# Altium schematic sheet 05_interface.SchDoc
size 513 x 386 mm
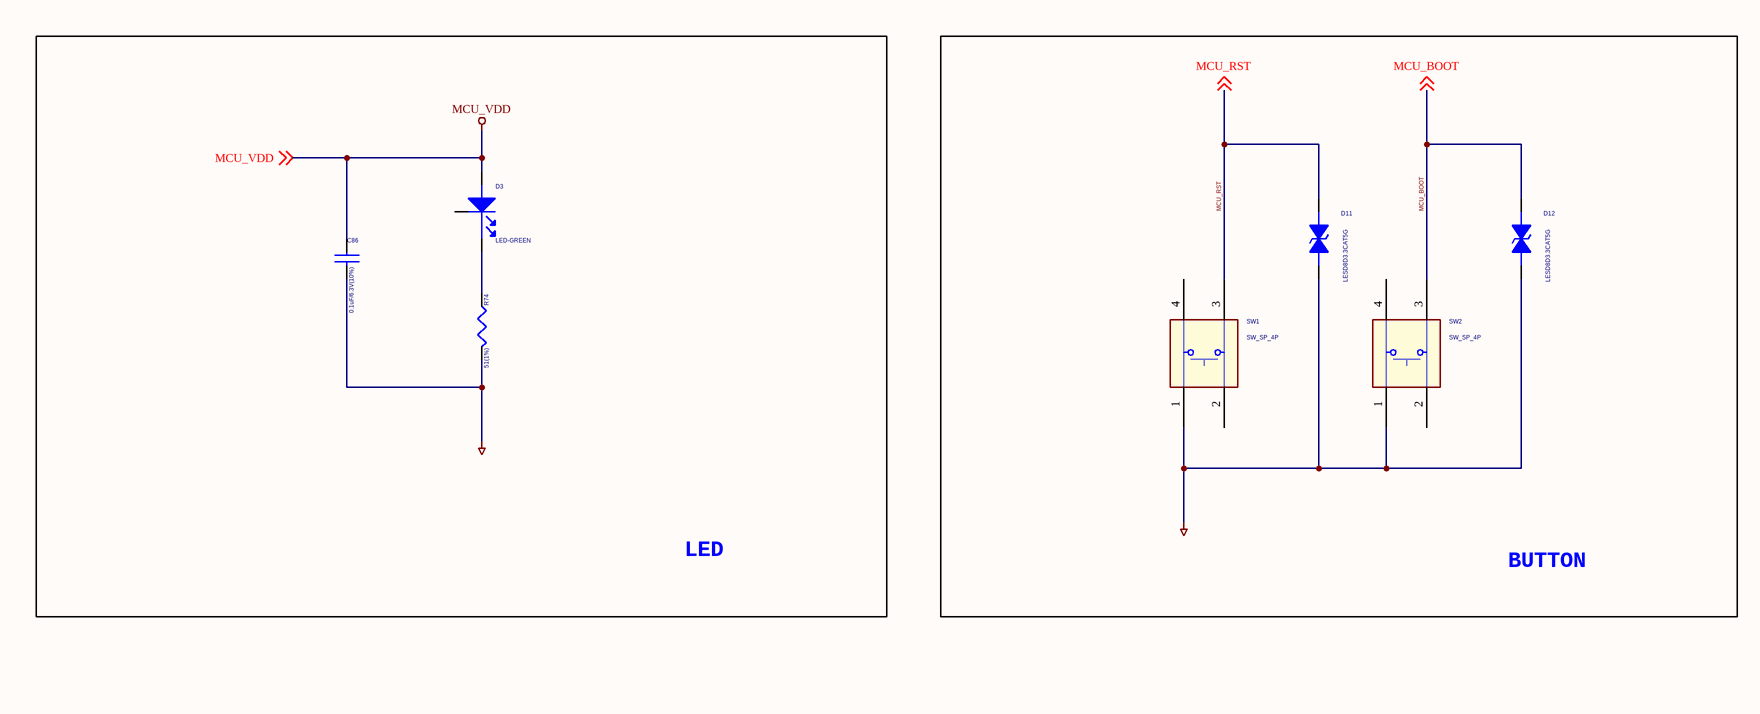
[diagram p0: 05_interface.SchDoc, left]
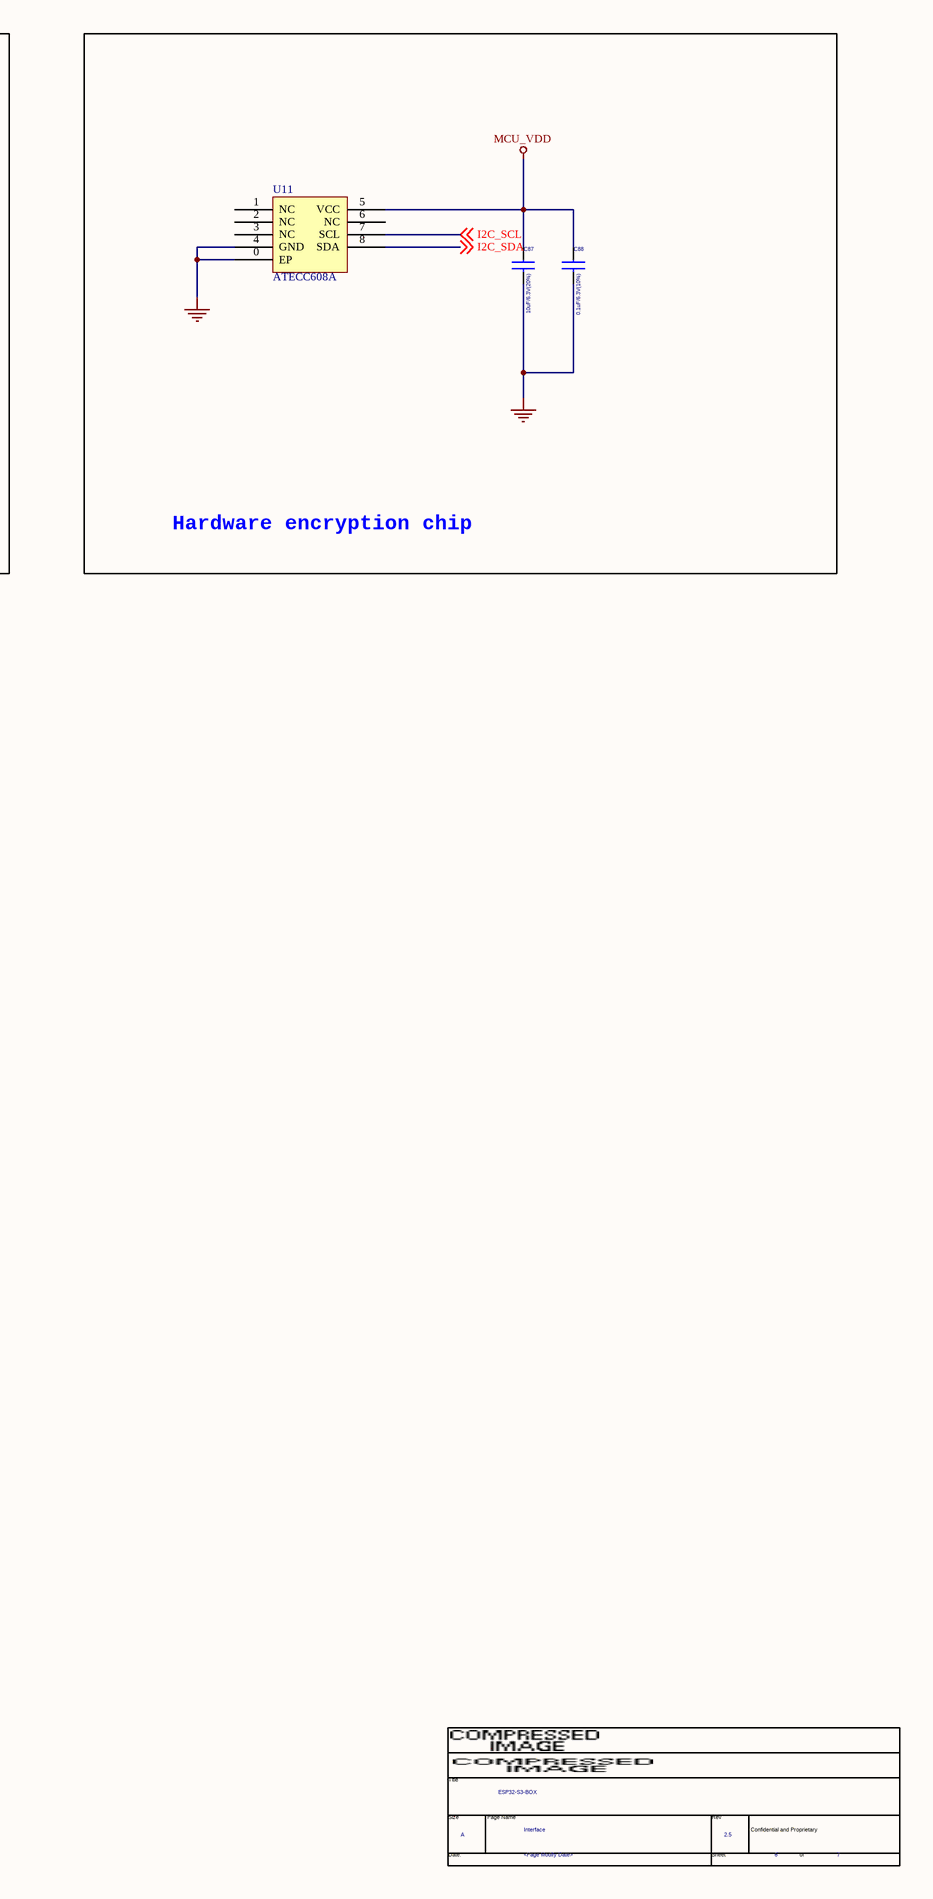
[diagram p1: 05_interface.SchDoc, right]

## Parts
*  Page Modify Date: <Page Modify Date>  Page Name: Interface  Title: ESP32-S3-BOX  Page Size: A  Page Number: 6  Page Count: 7  RevCode: 2.5  (hidden comment: espTitleBlock3)  (graphical)
C86  0.1uF/6.3V(10%)  [0402_C]
C87  10uF/6.3V(20%)  [0402_C]
C88  0.1uF/6.3V(10%)  [0402_C]
D3  LED-GREEN  [0603_L]
D11  LESD8D3.3CAT5G  [SOD-882]
D12  LESD8D3.3CAT5G  [SOD-882]
R74  51(1%)  [0201_R]
SW1  SW_SP_4P  [Key3*4*2.5]
SW2  SW_SP_4P  [Key3*4*2.5]
U11  ATECC608A  [DFN-8_EP_3x3mm]

## Blocks framed on the sheet
LED: C86 D3 R74
BUTTON: D11 D12 SW1 SW2
Hardware encryption chip: C87 C88 U11

## Nets
GND: C86.2 C87.2 C88.2 D11.1 D12.1 R74.2 SW1.1 SW2.1 U11.0(EP) U11.4(GND)
MCU_VDD: C86.1 C87.1 C88.1 D3.1 U11.5(VCC) ; off-sheet MCU_VDD
I2C_SCL: U11.7(SCL) ; off-sheet I2C_SCL
I2C_SDA: U11.8(SDA) ; off-sheet I2C_SDA
MCU_BOOT: D12.2 SW2.3 ; off-sheet MCU_BOOT
MCU_RST: D11.2 SW1.3 ; off-sheet MCU_RST
NetD3_2: D3.2 R74.1

Not connected (* = marked no-connect by the designer): D3 3; SW1 2 4; SW2 2 4; U11 1(NC) 2(NC) 3(NC) 6(NC)

## Notes on the sheet
- (in symbol espTitleBlock3) Title; Size; Page Name; Rev; Confidential and Proprietary; Date:; Sheet; of

## Library data of the parts
* = espTitleBlock3: Doc: ESP32-S3-EYE_V1.0; OrgName: ESPRESSIF
C86 C88 = CAPACITOR: Part Number: ES11045102620001; CODE12: ES11.04.510.2.6.2.00; Part Type: Capacitor
C87 = CAPACITOR: Part Number: ES11047102710000; CODE12: ES11.04.710.2.7.1.00; Part Type: Capacitor
D11 D12 = DIODE_BI_DIR: Part Number: ES31320010000000; CODE12: ES31.32.0010.00.0.0; Part Type: Diode
R74 = RESISTOR: Part Number: ES21021510000001; CODE12: ES21.02.1510.0.00.0; Part Type: Resistor
SW1 SW2 = SW_SP_4P: CLASS: DISCRETE; TIME: 2004-11-29